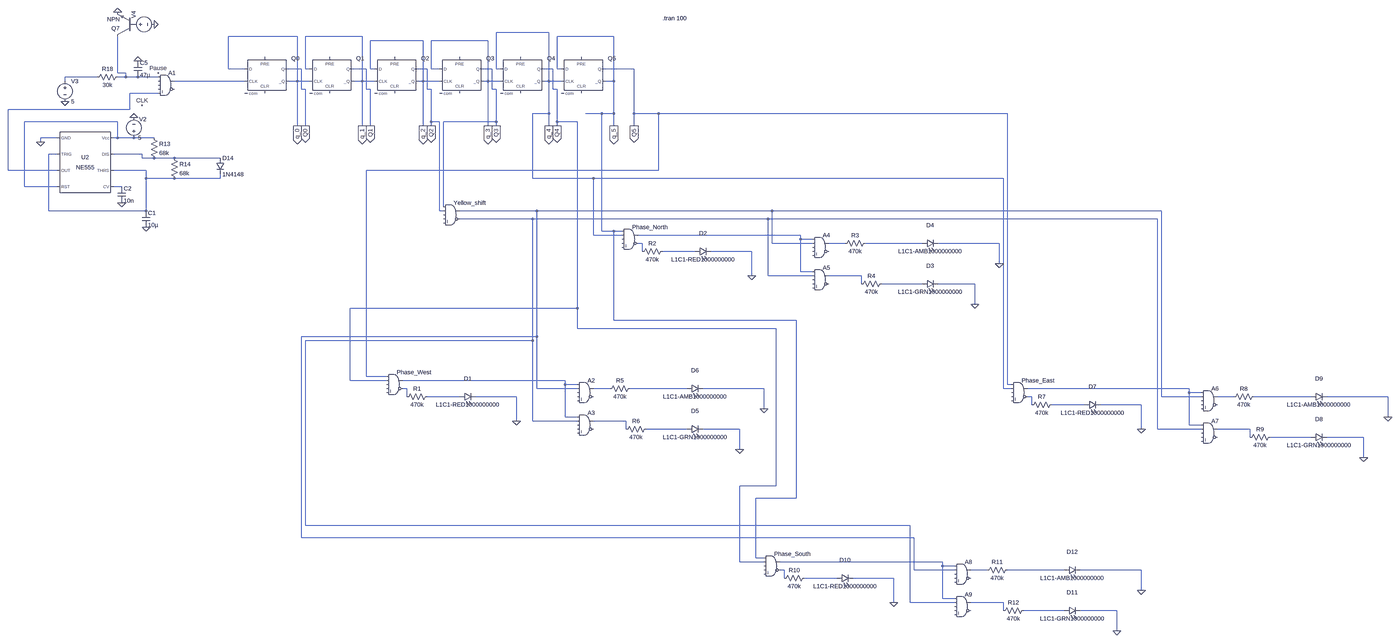
[diagram p0: schematic IPMP PROJ.asc, whole sheet]
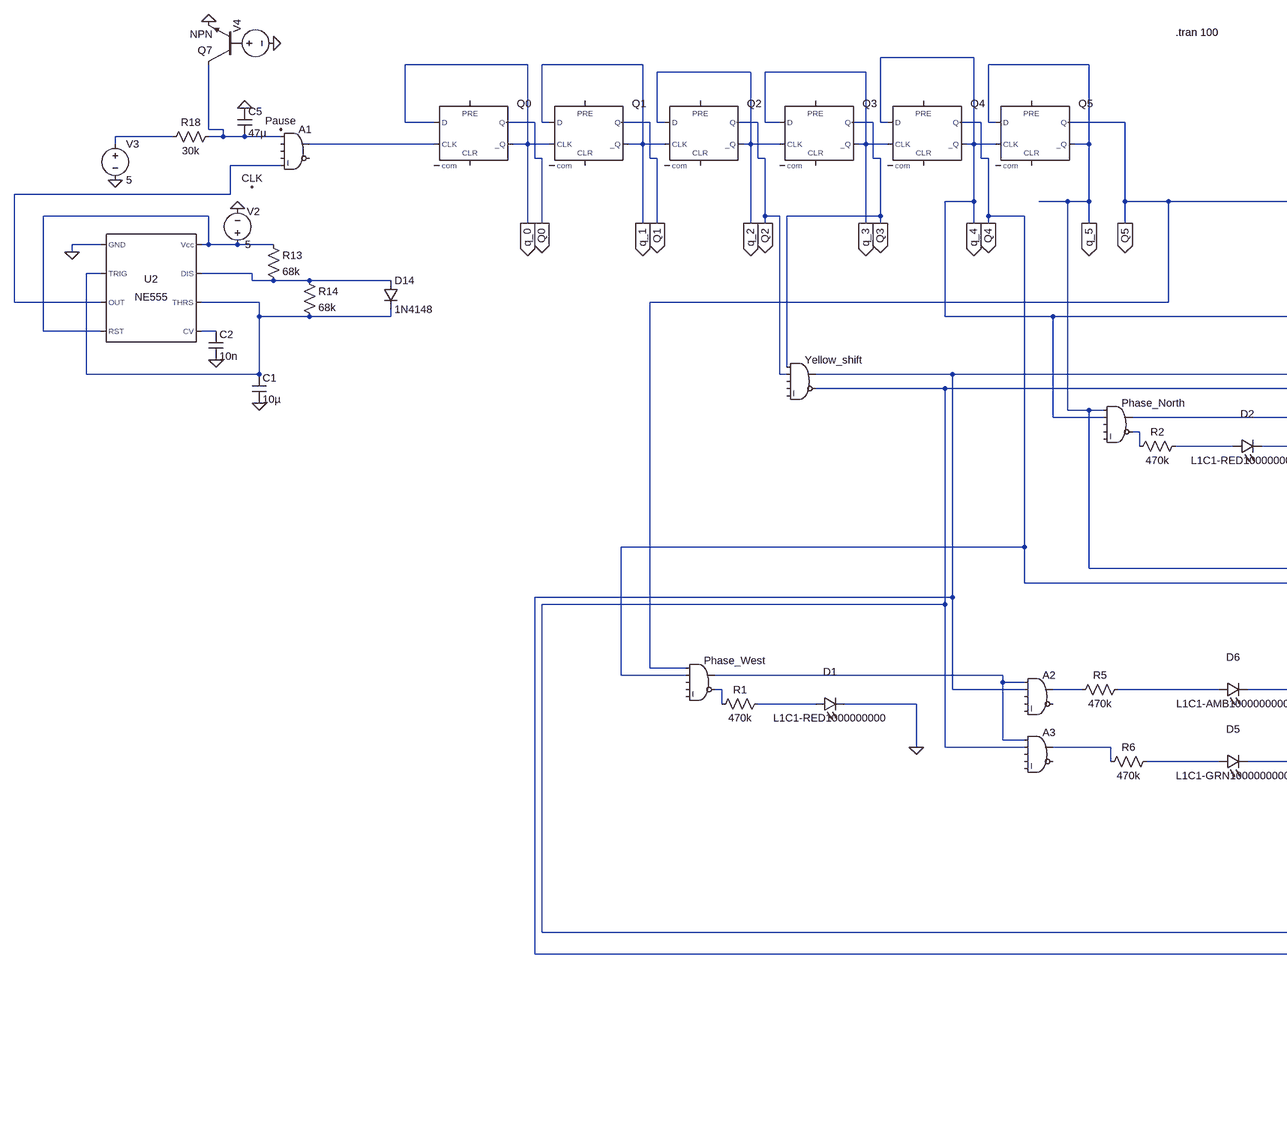
[diagram p1: schematic IPMP PROJ.asc, part, row 1 of 1, column 1 of 2]
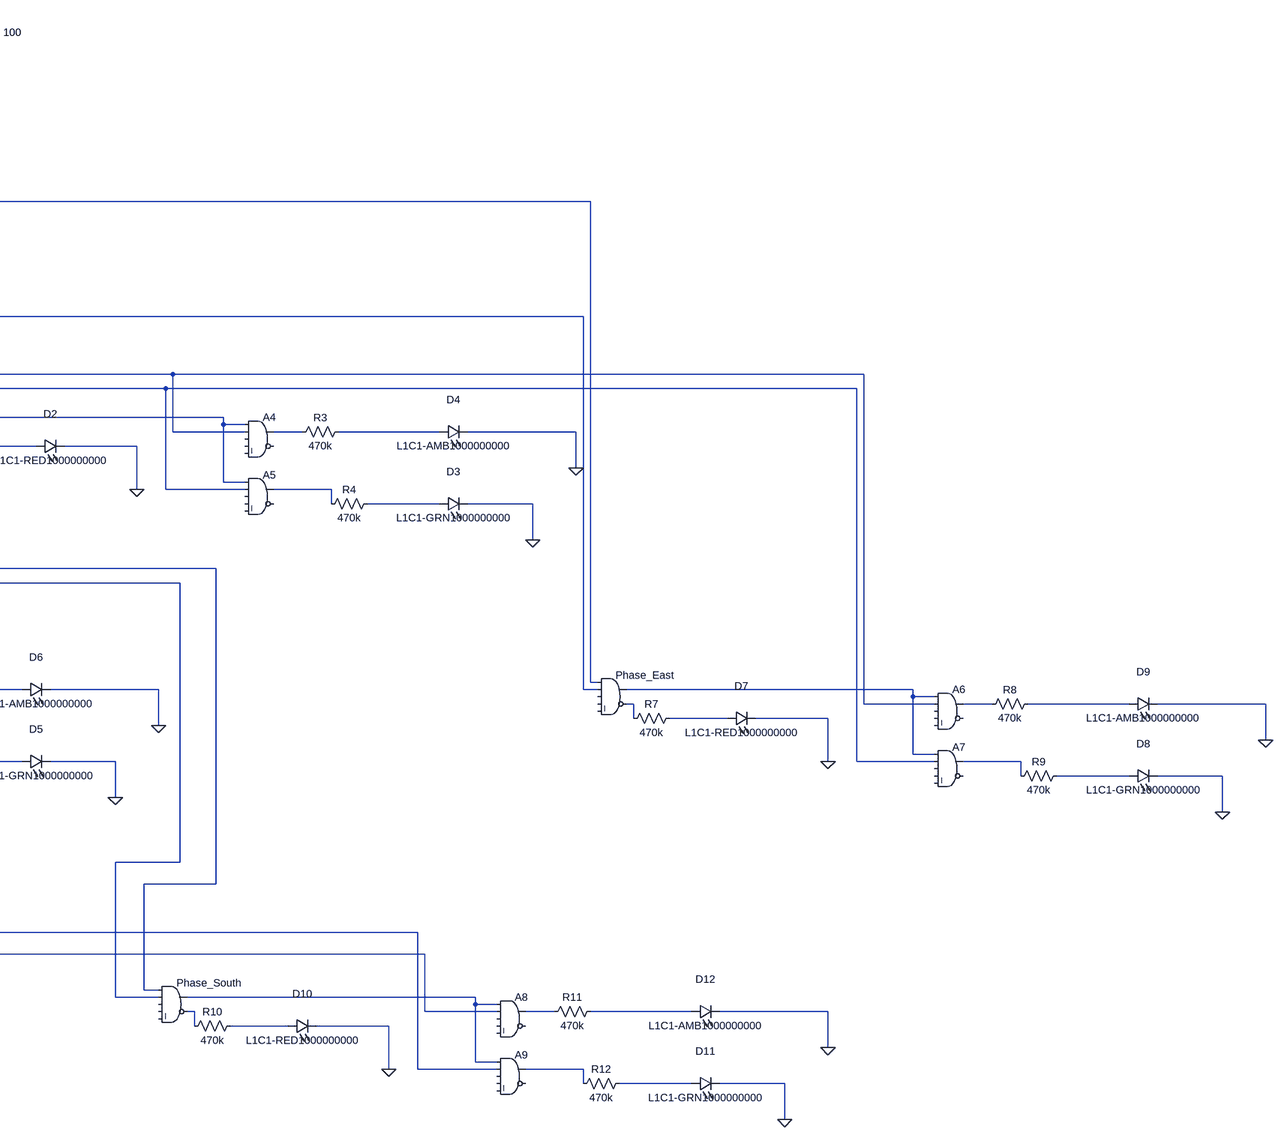
[diagram p2: schematic IPMP PROJ.asc, part, row 1 of 1, column 2 of 2]
IPMP PROJ.asc, the LTspice schematic file:
Version 4.1
SHEET 1 5876 2228
WIRE 2112 -288 1904 -288
WIRE 1120 -272 848 -272
WIRE 1376 -272 1152 -272
WIRE 2368 -272 2144 -272
WIRE 1616 -256 1408 -256
WIRE 1872 -256 1648 -256
WIRE 848 -144 848 -272
WIRE 912 -144 848 -144
WIRE 1136 -144 1072 -144
WIRE 1152 -144 1152 -272
WIRE 1168 -144 1152 -144
WIRE 1392 -144 1328 -144
WIRE 1408 -144 1408 -256
WIRE 1424 -144 1408 -144
WIRE 1632 -144 1584 -144
WIRE 1648 -144 1648 -256
WIRE 1680 -144 1648 -144
WIRE 1888 -144 1840 -144
WIRE 1904 -144 1904 -288
WIRE 1920 -144 1904 -144
WIRE 2128 -144 2080 -144
WIRE 2144 -144 2144 -272
WIRE 2160 -144 2144 -144
WIRE 2448 -144 2320 -144
WIRE 368 -128 368 -272
WIRE 400 -128 368 -128
WIRE 288 -112 160 -112
WIRE 400 -112 400 -128
WIRE 400 -112 368 -112
WIRE 448 -112 400 -112
WIRE 528 -112 448 -112
WIRE 160 -96 160 -112
WIRE 912 -96 592 -96
WIRE 1120 -96 1120 -272
WIRE 1120 -96 1088 -96
WIRE 1168 -96 1120 -96
WIRE 1376 -96 1376 -272
WIRE 1376 -96 1344 -96
WIRE 1424 -96 1376 -96
WIRE 1616 -96 1616 -256
WIRE 1616 -96 1600 -96
WIRE 1680 -96 1616 -96
WIRE 1872 -96 1872 -256
WIRE 1872 -96 1856 -96
WIRE 1920 -96 1872 -96
WIRE 2112 -96 2112 -288
WIRE 2112 -96 2096 -96
WIRE 2160 -96 2112 -96
WIRE 2368 -96 2368 -272
WIRE 2368 -96 2336 -96
WIRE 1136 -64 1136 -144
WIRE 1152 -64 1136 -64
WIRE 1392 -64 1392 -144
WIRE 1408 -64 1392 -64
WIRE 1632 -64 1632 -144
WIRE 1648 -64 1632 -64
WIRE 1888 -64 1888 -144
WIRE 1904 -64 1888 -64
WIRE 2128 -64 2128 -144
WIRE 2144 -64 2128 -64
WIRE 528 -48 416 -48
WIRE 416 16 416 -48
WIRE 416 16 -64 16
WIRE 2112 32 2112 -96
WIRE 2112 32 2048 32
WIRE 2320 32 2256 32
WIRE 2368 32 2368 -96
WIRE 2368 32 2320 32
WIRE 2448 32 2448 -144
WIRE 2544 32 2448 32
WIRE 3920 32 2544 32
WIRE 368 64 0 64
WIRE 1648 64 1648 -64
WIRE 1680 64 1648 64
WIRE 1904 64 1904 -64
WIRE 1904 64 1696 64
WIRE 2144 64 2144 -64
WIRE 2224 64 2144 64
WIRE 1120 80 1120 -96
WIRE 1152 80 1152 -64
WIRE 1376 80 1376 -96
WIRE 1408 80 1408 -64
WIRE 1616 80 1616 -96
WIRE 1648 80 1648 64
WIRE 1872 80 1872 -96
WIRE 1904 80 1904 64
WIRE 2112 80 2112 32
WIRE 2144 80 2144 64
WIRE 2368 80 2368 32
WIRE 2448 80 2448 32
WIRE 128 128 64 128
WIRE 368 128 368 64
WIRE 368 128 352 128
WIRE 432 128 368 128
WIRE 512 128 432 128
WIRE 64 144 64 128
WIRE 128 192 96 192
WIRE 464 192 352 192
WIRE 464 208 464 192
WIRE 512 208 464 208
WIRE 592 208 512 208
WIRE 816 208 592 208
WIRE -64 256 -64 16
WIRE 128 256 -64 256
WIRE 480 256 352 256
WIRE 2544 256 2544 32
WIRE 2544 256 1392 256
WIRE 480 288 480 256
WIRE 592 288 480 288
WIRE 816 288 816 272
WIRE 816 288 592 288
WIRE 2048 288 2048 32
WIRE 2288 288 2048 288
WIRE 3904 288 2288 288
WIRE 0 320 0 64
WIRE 128 320 0 320
WIRE 384 320 352 320
WIRE 1696 400 1696 64
WIRE 96 416 96 192
WIRE 480 416 480 288
WIRE 480 416 96 416
WIRE 1680 416 1680 64
WIRE 1696 416 1680 416
WIRE 2064 416 1760 416
WIRE 2992 416 2064 416
WIRE 4528 416 2992 416
WIRE 2048 448 1760 448
WIRE 2976 448 2048 448
WIRE 4512 448 2976 448
WIRE 2320 496 2320 32
WIRE 2368 496 2320 496
WIRE 2400 496 2368 496
WIRE 2288 512 2288 288
WIRE 2400 512 2288 512
WIRE 3104 512 2464 512
WIRE 3104 528 3104 512
WIRE 3152 528 3104 528
WIRE 2480 544 2464 544
WIRE 2992 544 2992 416
WIRE 3152 544 2992 544
WIRE 3280 544 3216 544
WIRE 3584 544 3360 544
WIRE 3888 544 3648 544
WIRE 2480 576 2480 544
WIRE 2688 576 2560 576
WIRE 2912 576 2752 576
WIRE 3888 624 3888 544
WIRE 3104 656 3104 528
WIRE 3152 656 3104 656
WIRE 2912 672 2912 576
WIRE 2976 672 2976 448
WIRE 3152 672 2976 672
WIRE 3344 672 3216 672
WIRE 3344 704 3344 672
WIRE 3584 704 3424 704
WIRE 3792 704 3648 704
WIRE 3792 784 3792 704
WIRE 2224 800 2224 64
WIRE 2224 800 1328 800
WIRE 2368 848 2368 496
WIRE 3088 848 2368 848
WIRE 2224 880 2224 800
WIRE 3008 880 2224 880
WIRE 2064 912 2064 416
WIRE 2064 912 1136 912
WIRE 2048 928 2048 448
WIRE 2048 928 1152 928
WIRE 1392 1104 1392 256
WIRE 1472 1104 1392 1104
WIRE 1328 1120 1328 800
WIRE 1472 1120 1328 1120
WIRE 2176 1120 1536 1120
WIRE 2176 1136 2176 1120
WIRE 2224 1136 2176 1136
WIRE 3920 1136 3920 32
WIRE 3936 1136 3920 1136
WIRE 1552 1152 1536 1152
WIRE 2064 1152 2064 912
WIRE 2224 1152 2064 1152
WIRE 2352 1152 2288 1152
WIRE 2656 1152 2432 1152
WIRE 2960 1152 2720 1152
WIRE 3904 1152 3904 288
WIRE 3936 1152 3904 1152
WIRE 4640 1152 4000 1152
WIRE 4640 1168 4640 1152
WIRE 4688 1168 4640 1168
WIRE 1552 1184 1552 1152
WIRE 1760 1184 1632 1184
WIRE 1984 1184 1824 1184
WIRE 4016 1184 4000 1184
WIRE 4528 1184 4528 416
WIRE 4688 1184 4528 1184
WIRE 4816 1184 4752 1184
WIRE 5120 1184 4896 1184
WIRE 5424 1184 5184 1184
WIRE 4016 1216 4016 1184
WIRE 4224 1216 4096 1216
WIRE 4448 1216 4288 1216
WIRE 2960 1232 2960 1152
WIRE 2176 1264 2176 1136
WIRE 2224 1264 2176 1264
WIRE 5424 1264 5424 1184
WIRE 1984 1280 1984 1184
WIRE 2048 1280 2048 928
WIRE 2224 1280 2048 1280
WIRE 2416 1280 2288 1280
WIRE 4640 1296 4640 1168
WIRE 4688 1296 4640 1296
WIRE 2416 1312 2416 1280
WIRE 2656 1312 2496 1312
WIRE 2864 1312 2720 1312
WIRE 4448 1312 4448 1216
WIRE 4512 1312 4512 448
WIRE 4688 1312 4512 1312
WIRE 4880 1312 4752 1312
WIRE 4880 1344 4880 1312
WIRE 5120 1344 4960 1344
WIRE 5328 1344 5184 1344
WIRE 2864 1392 2864 1312
WIRE 5328 1424 5328 1344
WIRE 3008 1536 3008 880
WIRE 3008 1536 2864 1536
WIRE 3088 1584 3088 848
WIRE 3088 1584 2928 1584
WIRE 1152 1792 1152 928
WIRE 3536 1792 1152 1792
WIRE 1136 1840 1136 912
WIRE 3552 1840 1136 1840
WIRE 2928 1920 2928 1584
WIRE 2960 1920 2928 1920
WIRE 2864 1936 2864 1536
WIRE 2960 1936 2864 1936
WIRE 3664 1936 3024 1936
WIRE 3664 1952 3664 1936
WIRE 3712 1952 3664 1952
WIRE 3040 1968 3024 1968
WIRE 3552 1968 3552 1840
WIRE 3712 1968 3552 1968
WIRE 3840 1968 3776 1968
WIRE 4144 1968 3920 1968
WIRE 4448 1968 4208 1968
WIRE 3040 2000 3040 1968
WIRE 3248 2000 3120 2000
WIRE 3472 2000 3312 2000
WIRE 4448 2048 4448 1968
WIRE 3664 2080 3664 1952
WIRE 3712 2080 3664 2080
WIRE 3472 2096 3472 2000
WIRE 3536 2096 3536 1792
WIRE 3712 2096 3536 2096
WIRE 3904 2096 3776 2096
WIRE 3904 2128 3904 2096
WIRE 4144 2128 3984 2128
WIRE 4352 2128 4208 2128
WIRE 4352 2208 4352 2128
FLAG 464 0 CLK
FLAG 528 -128 Pause
FLAG 1152 80 Q0
IOPIN 1152 80 Out
FLAG 1408 80 Q1
IOPIN 1408 80 Out
FLAG 1648 80 Q2
IOPIN 1648 80 Out
FLAG 1904 80 Q3
IOPIN 1904 80 Out
FLAG 2144 80 Q4
IOPIN 2144 80 Out
FLAG 2448 80 Q5
IOPIN 2448 80 Out
FLAG 1120 80 q_0
IOPIN 1120 80 Out
FLAG 1376 80 q_1
IOPIN 1376 80 Out
FLAG 1616 80 q_2
IOPIN 1616 80 Out
FLAG 1872 80 q_3
IOPIN 1872 80 Out
FLAG 2112 80 q_4
IOPIN 2112 80 Out
FLAG 2368 80 q_5
IOPIN 2368 80 Out
FLAG 1984 1280 0
FLAG 2960 1232 0
FLAG 2864 1392 0
FLAG 2912 672 0
FLAG 3888 624 0
FLAG 3792 784 0
FLAG 4448 1312 0
FLAG 5424 1264 0
FLAG 5328 1424 0
FLAG 3472 2096 0
FLAG 4448 2048 0
FLAG 4352 2208 0
FLAG 64 144 0
FLAG 480 480 0
FLAG 384 384 0
FLAG 432 48 0
FLAG 512 -320 0
FLAG 160 -16 0
FLAG 368 -368 0
FLAG 448 -176 0
DATAFLAG 656 -96 ""
SYMBOL Digital\\dflop 992 -192 R0
SYMATTR InstName Q0
SYMATTR SpiceLine Vhigh=5 Vlow=0 Td=5n Trise=10n Tfall=10n
SYMBOL Digital\\dflop 1248 -192 R0
SYMATTR InstName Q1
SYMATTR SpiceLine Vhigh=5 Vlow=0 Td=5n Trise=10n Tfall=10n
SYMBOL Digital\\dflop 1504 -192 R0
SYMATTR InstName Q2
SYMATTR SpiceLine Vhigh=5 Vlow=0 Td=5n Trise=10n Tfall=10n
SYMBOL Digital\\dflop 1760 -192 R0
SYMATTR InstName Q3
SYMATTR SpiceLine Vhigh=5 Vlow=0 Td=5n Trise=10n Tfall=10n
SYMBOL Digital\\dflop 2000 -192 R0
SYMATTR InstName Q4
SYMATTR SpiceLine Vhigh=5 Vlow=0 Td=5n Trise=10n Tfall=10n
SYMBOL Digital\\dflop 2240 -192 R0
SYMATTR InstName Q5
SYMATTR SpiceLine Vhigh=5 Vlow=0 Td=5n Trise=10n Tfall=10n
SYMBOL Digital\\and 1504 1072 R0
SYMATTR InstName Phase_West
SYMATTR SpiceLine Vhigh=5 Vlow=0 Trise=10n Tfall=10n Td=5n
SYMBOL Digital\\and 2992 1888 R0
SYMATTR InstName Phase_South
SYMATTR SpiceLine Vhigh=5 Vlow=0 Trise=10n Tfall=10n Td=5n
SYMBOL Digital\\and 3968 1104 R0
SYMATTR InstName Phase_East
SYMATTR SpiceLine Vhigh=5 Vlow=0 Trise=10n Tfall=10n Td=5n
SYMBOL Digital\\and 2432 464 R0
SYMATTR InstName Phase_North
SYMATTR SpiceLine Vhigh=5 Vlow=0 Trise=10n Tfall=10n Td=5n
SYMBOL Digital\\and 1728 368 R0
SYMATTR InstName Yellow_shift
SYMATTR SpiceLine Vhigh=5 Vlow=0 Trise=10n Tfall=10n Td=5n
SYMBOL LED 1760 1200 R270
WINDOW 0 72 32 VTop 2
WINDOW 3 0 32 VBottom 2
SYMATTR InstName D1
SYMATTR Value L1C1-RED1000000000
SYMBOL res 1648 1168 R90
WINDOW 0 0 56 VBottom 2
WINDOW 3 32 56 VTop 2
SYMATTR InstName R1
SYMATTR Value 470k
SYMATTR SpiceLine tol=1 pwr=0.1
SYMBOL LED 2656 1328 R270
WINDOW 0 72 32 VTop 2
WINDOW 3 0 32 VBottom 2
SYMATTR InstName D5
SYMATTR Value L1C1-GRN1000000000
SYMBOL res 2448 1136 R90
WINDOW 0 0 56 VBottom 2
WINDOW 3 32 56 VTop 2
SYMATTR InstName R5
SYMATTR Value 470k
SYMATTR SpiceLine tol=1 pwr=0.1
SYMBOL Digital\\and 2256 1104 R0
SYMATTR InstName A2
SYMATTR SpiceLine Vhigh=5 Vlow=0 Trise=10n Tfall=10n Td=5n
SYMBOL Digital\\and 2256 1232 R0
SYMATTR InstName A3
SYMATTR SpiceLine Vhigh=5 Vlow=0 Trise=10n Tfall=10n Td=5n
SYMBOL LED 2656 1168 R270
WINDOW 0 72 32 VTop 2
WINDOW 3 0 32 VBottom 2
SYMATTR InstName D6
SYMATTR Value L1C1-AMB1000000000
SYMBOL res 2512 1296 R90
WINDOW 0 0 56 VBottom 2
WINDOW 3 32 56 VTop 2
SYMATTR InstName R6
SYMATTR Value 470k
SYMATTR SpiceLine tol=1 pwr=0.1
SYMBOL LED 2688 592 R270
WINDOW 0 72 32 VTop 2
WINDOW 3 0 32 VBottom 2
SYMATTR InstName D2
SYMATTR Value L1C1-RED1000000000
SYMBOL res 2576 560 R90
WINDOW 0 0 56 VBottom 2
WINDOW 3 32 56 VTop 2
SYMATTR InstName R2
SYMATTR Value 470k
SYMATTR SpiceLine tol=1 pwr=0.1
SYMBOL LED 3584 720 R270
WINDOW 0 72 32 VTop 2
WINDOW 3 0 32 VBottom 2
SYMATTR InstName D3
SYMATTR Value L1C1-GRN1000000000
SYMBOL res 3376 528 R90
WINDOW 0 0 56 VBottom 2
WINDOW 3 32 56 VTop 2
SYMATTR InstName R3
SYMATTR Value 470k
SYMATTR SpiceLine tol=1 pwr=0.1
SYMBOL Digital\\and 3184 496 R0
SYMATTR InstName A4
SYMATTR SpiceLine Vhigh=5 Vlow=0 Trise=10n Tfall=10n Td=5n
SYMBOL Digital\\and 3184 624 R0
SYMATTR InstName A5
SYMATTR SpiceLine Vhigh=5 Vlow=0 Trise=10n Tfall=10n Td=5n
SYMBOL LED 3584 560 R270
WINDOW 0 72 32 VTop 2
WINDOW 3 0 32 VBottom 2
SYMATTR InstName D4
SYMATTR Value L1C1-AMB1000000000
SYMBOL res 3440 688 R90
WINDOW 0 0 56 VBottom 2
WINDOW 3 32 56 VTop 2
SYMATTR InstName R4
SYMATTR Value 470k
SYMATTR SpiceLine tol=1 pwr=0.1
SYMBOL LED 4224 1232 R270
WINDOW 0 72 32 VTop 2
WINDOW 3 0 32 VBottom 2
SYMATTR InstName D7
SYMATTR Value L1C1-RED1000000000
SYMBOL res 4112 1200 R90
WINDOW 0 0 56 VBottom 2
WINDOW 3 32 56 VTop 2
SYMATTR InstName R7
SYMATTR Value 470k
SYMATTR SpiceLine tol=1 pwr=0.1
SYMBOL LED 5120 1360 R270
WINDOW 0 72 32 VTop 2
WINDOW 3 0 32 VBottom 2
SYMATTR InstName D8
SYMATTR Value L1C1-GRN1000000000
SYMBOL res 4912 1168 R90
WINDOW 0 0 56 VBottom 2
WINDOW 3 32 56 VTop 2
SYMATTR InstName R8
SYMATTR Value 470k
SYMATTR SpiceLine tol=1 pwr=0.1
SYMBOL Digital\\and 4720 1136 R0
SYMATTR InstName A6
SYMATTR SpiceLine Vhigh=5 Vlow=0 Trise=10n Tfall=10n Td=5n
SYMBOL Digital\\and 4720 1264 R0
SYMATTR InstName A7
SYMATTR SpiceLine Vhigh=5 Vlow=0 Trise=10n Tfall=10n Td=5n
SYMBOL LED 5120 1200 R270
WINDOW 0 72 32 VTop 2
WINDOW 3 0 32 VBottom 2
SYMATTR InstName D9
SYMATTR Value L1C1-AMB1000000000
SYMBOL res 4976 1328 R90
WINDOW 0 0 56 VBottom 2
WINDOW 3 32 56 VTop 2
SYMATTR InstName R9
SYMATTR Value 470k
SYMATTR SpiceLine tol=1 pwr=0.1
SYMBOL LED 3248 2016 R270
WINDOW 0 72 32 VTop 2
WINDOW 3 0 32 VBottom 2
SYMATTR InstName D10
SYMATTR Value L1C1-RED1000000000
SYMBOL res 3136 1984 R90
WINDOW 0 0 56 VBottom 2
WINDOW 3 32 56 VTop 2
SYMATTR InstName R10
SYMATTR Value 470k
SYMATTR SpiceLine tol=1 pwr=0.1
SYMBOL LED 4144 2144 R270
WINDOW 0 72 32 VTop 2
WINDOW 3 0 32 VBottom 2
SYMATTR InstName D11
SYMATTR Value L1C1-GRN1000000000
SYMBOL res 3936 1952 R90
WINDOW 0 0 56 VBottom 2
WINDOW 3 32 56 VTop 2
SYMATTR InstName R11
SYMATTR Value 470k
SYMATTR SpiceLine tol=1 pwr=0.1
SYMBOL Digital\\and 3744 1920 R0
SYMATTR InstName A8
SYMATTR SpiceLine Vhigh=5 Vlow=0 Trise=10n Tfall=10n Td=5n
SYMBOL Digital\\and 3744 2048 R0
SYMATTR InstName A9
SYMATTR SpiceLine Vhigh=5 Vlow=0 Trise=10n Tfall=10n Td=5n
SYMBOL LED 4144 1984 R270
WINDOW 0 72 32 VTop 2
WINDOW 3 0 32 VBottom 2
SYMATTR InstName D12
SYMATTR Value L1C1-AMB1000000000
SYMBOL res 4000 2112 R90
WINDOW 0 0 56 VBottom 2
WINDOW 3 32 56 VTop 2
SYMATTR InstName R12
SYMATTR Value 470k
SYMATTR SpiceLine tol=1 pwr=0.1
SYMBOL Misc\\NE555 240 224 R0
SYMATTR InstName U2
SYMBOL res 496 112 R0
SYMATTR InstName R13
SYMATTR Value 68k
SYMATTR SpiceLine tol=1 pwr=0.1
SYMBOL res 576 192 R0
SYMATTR InstName R14
SYMATTR Value 68k
SYMATTR SpiceLine tol=1 pwr=0.1
SYMBOL cap 464 416 R0
SYMATTR InstName C1
SYMATTR Value 10µ
SYMBOL cap 368 320 R0
SYMATTR InstName C2
SYMATTR Value 10n
SYMBOL voltage 432 144 R180
WINDOW 0 -50 90 Left 2
WINDOW 3 -30 16 Left 2
WINDOW 123 0 0 Left 0
WINDOW 39 0 0 Left 0
SYMATTR InstName V2
SYMATTR Value 5
SYMBOL diode 800 208 R0
SYMATTR InstName D14
SYMATTR Value 1N4148
SYMBOL voltage 416 -320 R270
WINDOW 123 0 0 Left 0
WINDOW 39 0 0 Left 0
WINDOW 3 24 96 Invisible 2
SYMATTR Value PULSE(0 5 20 10n 10n 2 3 1)
SYMATTR InstName V4
SYMBOL Digital\\and 560 -144 R0
SYMATTR InstName A1
SYMATTR SpiceLine Vhigh=5 Vlow=0 Trise=10n Tfall=10n Td=5n
SYMBOL voltage 160 -112 R0
WINDOW 123 0 0 Left 0
WINDOW 39 0 0 Left 0
SYMATTR InstName V3
SYMATTR Value 5
SYMBOL res 384 -128 R90
WINDOW 0 0 56 VBottom 2
WINDOW 3 32 56 VTop 2
SYMATTR InstName R18
SYMATTR Value 30k
SYMBOL cap 432 -176 R0
SYMATTR InstName C5
SYMATTR Value 47µ
SYMBOL npn 432 -272 R180
SYMATTR InstName Q7
TEXT 2560 -344 Left 2 !.tran 100

The netlist it stands for:
* IPMP PROJ.asc
A§Q0 q_0 0 N003 0 0 q_0 Q0 0 DFLOP Vhigh=5 Vlow=0 Td=5n Trise=10n Tfall=10n
A§Q1 q_1 0 q_0 0 0 q_1 Q1 0 DFLOP Vhigh=5 Vlow=0 Td=5n Trise=10n Tfall=10n
A§Q2 q_2 0 q_1 0 0 q_2 Q2 0 DFLOP Vhigh=5 Vlow=0 Td=5n Trise=10n Tfall=10n
A§Q3 q_3 0 q_2 0 0 q_3 Q3 0 DFLOP Vhigh=5 Vlow=0 Td=5n Trise=10n Tfall=10n
A§Q4 q_4 0 q_3 0 0 q_4 Q4 0 DFLOP Vhigh=5 Vlow=0 Td=5n Trise=10n Tfall=10n
A§Q5 q_5 0 q_4 0 0 q_5 Q5 0 DFLOP Vhigh=5 Vlow=0 Td=5n Trise=10n Tfall=10n
A§Phase_West Q5 Q4 0 0 0 N019 N018 0 AND Vhigh=5 Vlow=0 Trise=10n Tfall=10n Td=5n
A§Phase_South q_5 Q4 0 0 0 N033 N032 0 AND Vhigh=5 Vlow=0 Trise=10n Tfall=10n Td=5n
A§Phase_East Q5 q_4 0 0 0 N024 N022 0 AND Vhigh=5 Vlow=0 Trise=10n Tfall=10n Td=5n
A§Phase_North q_5 q_4 0 0 0 N012 N011 0 AND Vhigh=5 Vlow=0 Trise=10n Tfall=10n Td=5n
A§Yellow_shift Q3 Q2 0 0 0 N010 N009 0 AND Vhigh=5 Vlow=0 Trise=10n Tfall=10n Td=5n
D1 N023 0 L1C1-RED1000000000
R1 N023 N019 470k tol=1 pwr=0.1
D5 N029 0 L1C1-GRN1000000000
R5 N021 N020 470k tol=1 pwr=0.1
A2 N018 N009 0 0 0 0 N020 0 AND Vhigh=5 Vlow=0 Trise=10n Tfall=10n Td=5n
A3 N018 N010 0 0 0 0 N028 0 AND Vhigh=5 Vlow=0 Trise=10n Tfall=10n Td=5n
D6 N021 0 L1C1-AMB1000000000
R6 N029 N028 470k tol=1 pwr=0.1
D2 N015 0 L1C1-RED1000000000
R2 N015 N012 470k tol=1 pwr=0.1
D3 N017 0 L1C1-GRN1000000000
R3 N014 N013 470k tol=1 pwr=0.1
A4 N011 N009 0 0 0 0 N013 0 AND Vhigh=5 Vlow=0 Trise=10n Tfall=10n Td=5n
A5 N011 N010 0 0 0 0 N016 0 AND Vhigh=5 Vlow=0 Trise=10n Tfall=10n Td=5n
D4 N014 0 L1C1-AMB1000000000
R4 N017 N016 470k tol=1 pwr=0.1
D7 N027 0 L1C1-RED1000000000
R7 N027 N024 470k tol=1 pwr=0.1
D8 N031 0 L1C1-GRN1000000000
R8 N026 N025 470k tol=1 pwr=0.1
A6 N022 N009 0 0 0 0 N025 0 AND Vhigh=5 Vlow=0 Trise=10n Tfall=10n Td=5n
A7 N022 N010 0 0 0 0 N030 0 AND Vhigh=5 Vlow=0 Trise=10n Tfall=10n Td=5n
D9 N026 0 L1C1-AMB1000000000
R9 N031 N030 470k tol=1 pwr=0.1
D10 N036 0 L1C1-RED1000000000
R10 N036 N033 470k tol=1 pwr=0.1
D11 N038 0 L1C1-GRN1000000000
R11 N035 N034 470k tol=1 pwr=0.1
A8 N032 N009 0 0 0 0 N034 0 AND Vhigh=5 Vlow=0 Trise=10n Tfall=10n Td=5n
A9 N032 N010 0 0 0 0 N037 0 AND Vhigh=5 Vlow=0 Trise=10n Tfall=10n Td=5n
D12 N035 0 L1C1-AMB1000000000
R12 N038 N037 470k tol=1 pwr=0.1
X§U2 0 N006 N004 N005 N008 N006 N007 N005 NE555  ; pins GND TRIG OUT RST CV THRS DIS Vcc
R13 N005 N007 68k tol=1 pwr=0.1
R14 N007 N006 68k tol=1 pwr=0.1
C1 N006 0 10µ
C2 N008 0 10n
V2 N005 0 5
D14 N007 N006 1N4148
V4 P001 0 PULSE(0 5 20 10n 10n 2 3 1)
A1 N001 0 0 0 N004 0 N003 0 AND Vhigh=5 Vlow=0 Trise=10n Tfall=10n Td=5n
V3 N002 0 5
R18 N001 N002 30k
C5 0 N001 47µ
Q7 N001 P001 0 0 NPN
.model D D
.lib standard.dio
.model NPN NPN
.model PNP PNP
.lib standard.bjt
.tran 100
.lib NE555.sub
.backanno
.end